# EAGLE schematic BlueCom_Board (EAGLE 6.2)
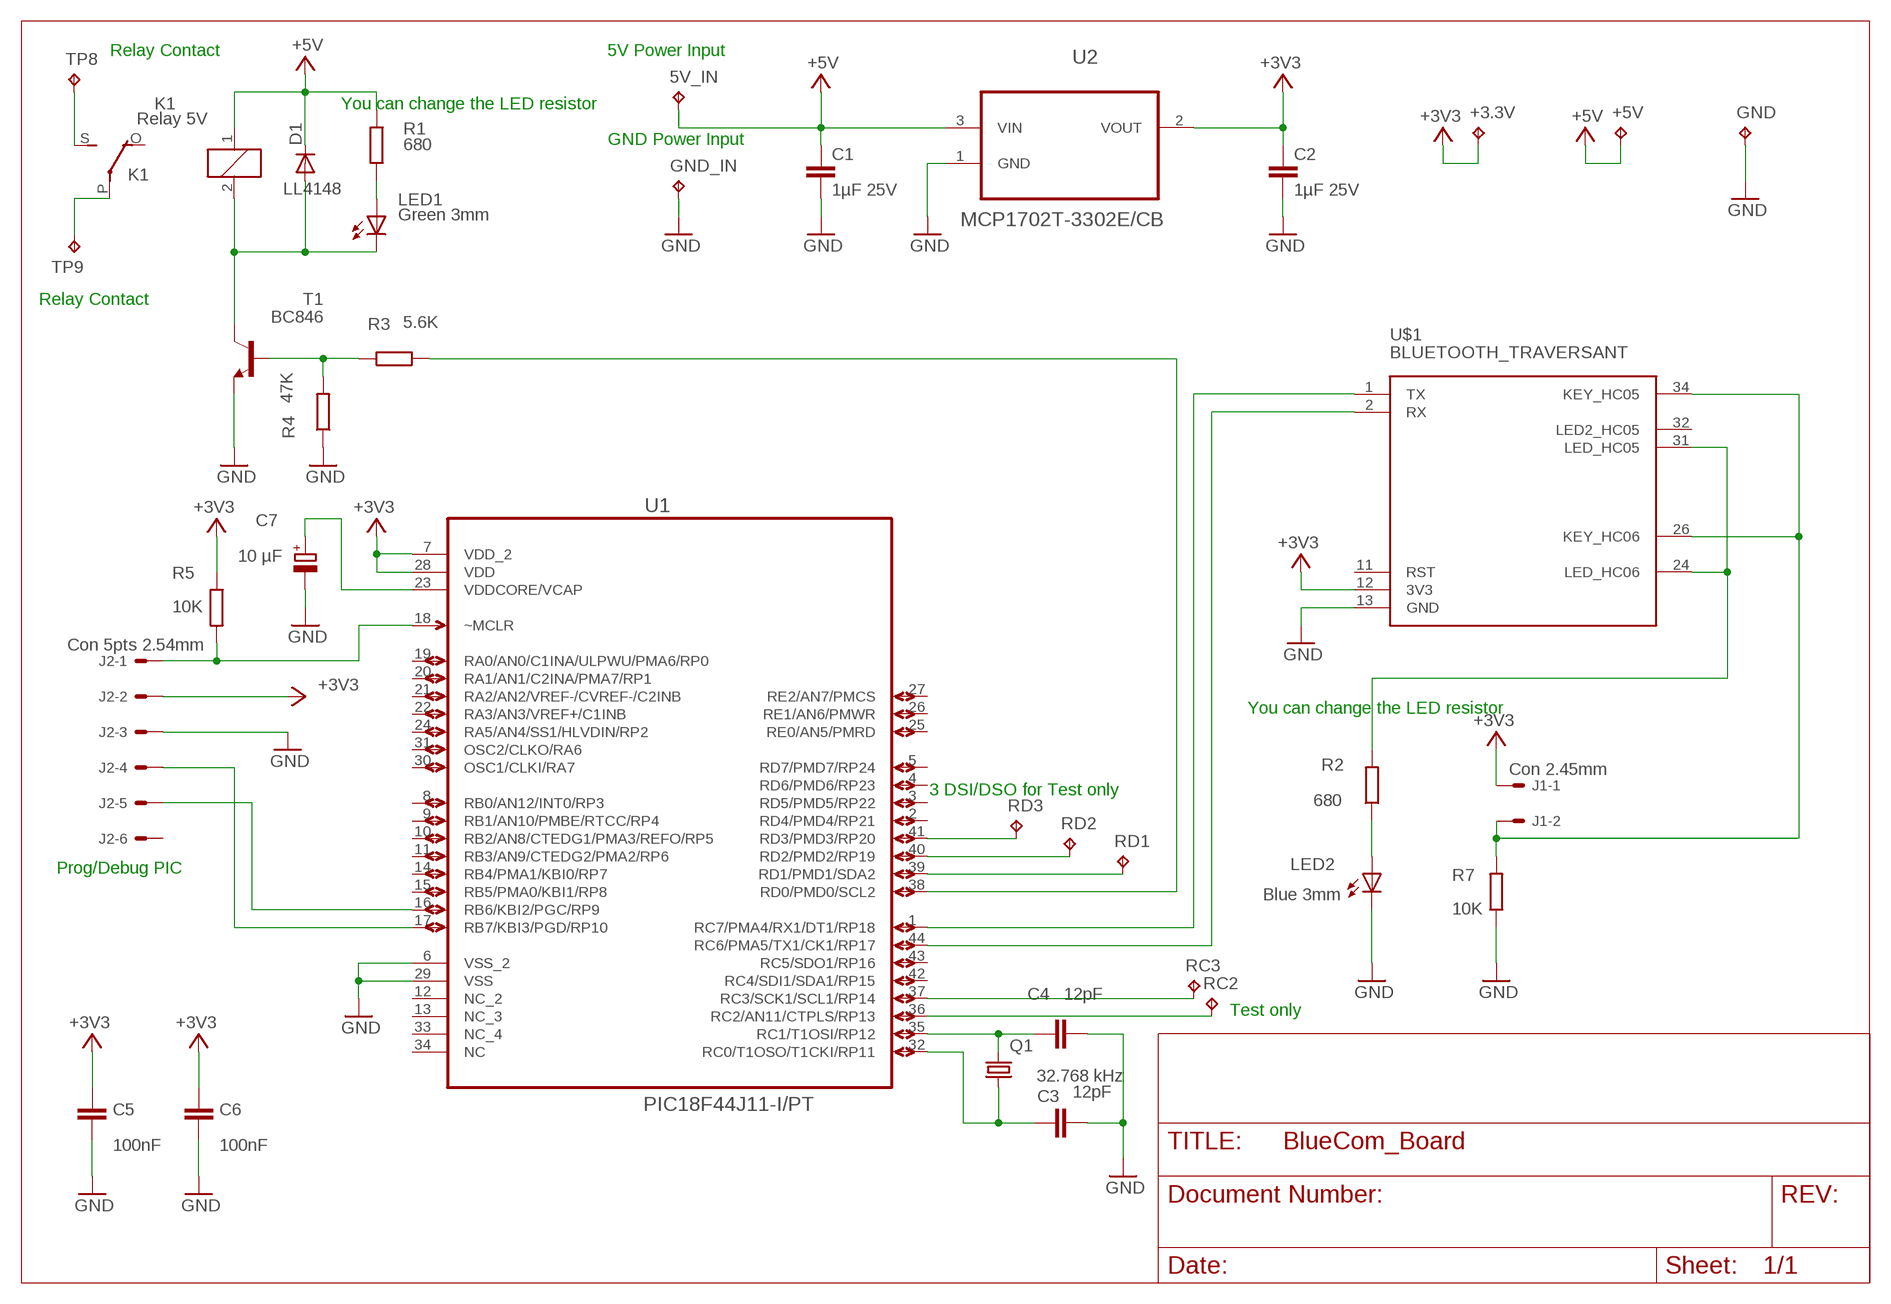
[diagram p0: schematic, sheet 1]

## Parts
5V_IN  TPPAD1-13Y  [P1-13Y]
+3.3V  TPPAD1-13  [P1-13]
+5V  TPPAD1-13  [P1-13]
C1  1µF 25V  C-EUC0805  [C0805]
C2  1µF 25V  C-EUC0805  [C0805]
C3  12pF  C-EUC0805  [C0805]
C4  12pF  C-EUC0805  [C0805]
C5  100nF  C-EUC0805  [C0805]
C6  100nF  C-EUC0805  [C0805]
C7  10 µF  CPOL-EUA/3216-18W  [A/3216-18W]
D1  LL4148  PMLL41SOD80C  [SOD80C]
GND  TPPAD1-13  [P1-13]
GND_IN  TPPAD1-13Y  [P1-13Y]
J1  Con 2.45mm  22-27-2021-02  [6410-02]
J2  Con 5pts 2.54mm  22-27-2061-06  [6410-06]
K1  Relay 5V  ZF112  [ZF112]
LED1  Green 3mm  LED3MM  [LED3MM]
LED2  Blue 3mm  LED3MM  [LED3MM]
Q1  32.768 kHz  CRYSTALTC26H  [TC26H]
R1  680  R-EU_R0805  [R0805]
R2  680  R-EU_R0805  [R0805]
R3  5.6K  R-EU_R0805  [R0805]
R4  47K  R-EU_R0805  [R0805]
R5  10K  R-EU_R0805  [R0805]
R7  10K  R-EU_R0805  [R0805]
RC2  TPPAD1-13  [P1-13]
RC3  TPPAD1-13  [P1-13]
RD1  TPPAD1-13  [P1-13]
RD2  TPPAD1-13  [P1-13]
RD3  TPPAD1-13  [P1-13]
T1  BC846  [SOT23]
TP8  TPPAD1-13Y  TPPAD1-20Y  [P1-20Y]
TP9  TPPAD1-13Y  TPPAD1-20Y  [P1-20Y]
U1  PIC18F44J11-I/PT  [QFP80P1200X1200X120-44N]
U2  MCP1702T-3302E/CB  [SOT95P255X145-3N]
U$1  BLUETOOTH_TRAVERSANT  [BLUETOOTH_TRAVERSANT]

## Nets
+3V3: +3.3V.TP C2.1 C5.1 C6.1 J1.1 J2.2 R5.1 U1.7(VDD_2) U1.28(VDD) U2.2(VOUT) U$1.12(3V3)
+5V: 5V_IN.TP +5V.TP C1.1 D1.C K1.1 R1.2 U2.3(VIN)
GND: C1.2 C2.2 C3.2 C4.2 C5.2 C6.2 C7.- GND.TP GND_IN.TP J2.3 LED2.K(C) R4.1 R7.1 T1.2(E) U1.6(VSS_2) U1.29(VSS) U2.1(GND) U$1.13(GND)
N$1: D1.A K1.2 LED1.K(C) T1.3(C)
N$2: R3.1 R4.2 T1.1(B)
N$3: RD3.TP U1.41(RD3/PMD3/RP20)
N$4: LED1.A R1.1
N$5: LED2.A R2.1
N$6: R2.2 U$1.24(LED_HC06) U$1.31(LED_HC05)
N$7: J1.2 R7.2 U$1.26(KEY_HC06) U$1.34(KEY_HC05)
N$8: U1.44(RC6/PMA5/TX1/CK1/RP17) U$1.2(RX)
N$9: U1.1(RC7/PMA4/RX1/DT1/RP18) U$1.1(TX)
N$10: K1.S(2:S) TP8.TP
N$11: K1.P(2:P) TP9.TP
N$12: J2.1 R5.2 U1.18(~MCLR)
N$13: C4.1 Q1.2 U1.35(RC1/T1OSI/RP12)
N$14: C3.1 Q1.1 U1.32(RC0/T1OSO/T1CKI/RP11)
N$15: J2.5 U1.16(RB6/KBI2/PGC/RP9)
N$16: RD2.TP U1.40(RD2/PMD2/RP19)
N$17: C7.+ U1.23(VDDCORE/VCAP)
N$18: R3.2 U1.38(RD0/PMD0/SCL2)
N$19: J2.4 U1.17(RB7/KBI3/PGD/RP10)
N$20: RD1.TP U1.39(RD1/PMD1/SDA2)
N$21: RC2.TP U1.36(RC2/AN11/CTPLS/RP13)
N$22: RC3.TP U1.37(RC3/SCK1/SCL1/RP14)
Unconnected: J2.6 K1.O(2:O) U1.2(RD4/PMD4/RP21) U1.3(RD5/PMD5/RP22) U1.4(RD6/PMD6/RP23) U1.5(RD7/PMD7/RP24) U1.8(RB0/AN12/INT0/RP3) U1.9(RB1/AN10/PMBE/RTCC/RP4) U1.10(RB2/AN8/CTEDG1/PMA3/REFO/RP5) U1.11(RB3/AN9/CTEDG2/PMA2/RP6) U1.12(NC_2) U1.13(NC_3) U1.14(RB4/PMA1/KBI0/RP7) U1.15(RB5/PMA0/KBI1/RP8) U1.19(RA0/AN0/C1INA/ULPWU/PMA6/RP0) U1.20(RA1/AN1/C2INA/PMA7/RP1) U1.21(RA2/AN2/VREF-/CVREF-/C2INB) U1.22(RA3/AN3/VREF+/C1INB) U1.24(RA5/AN4/SS1/HLVDIN/RP2) U1.25(RE0/AN5/PMRD) U1.26(RE1/AN6/PMWR) U1.27(RE2/AN7/PMCS) U1.30(OSC1/CLKI/RA7) U1.31(OSC2/CLKO/RA6) U1.33(NC_4) U1.34(NC) U1.42(RC4/SDI1/SDA1/RP15) U1.43(RC5/SDO1/RP16) U$1.11(RST) U$1.32(LED2_HC05)

## Notes on the sheet
- Relay Contact | 5V Power Input
- You can change the LED resistor
- GND Power Input
- Relay Contact
- You can change the LED resistor
- 3 DSI/DSO for Test only
- Prog/Debug PIC
- Test only

## Library data of the parts
5V_IN +3.3V +5V GND GND_IN RC2 RC3 RD1-RD3 TP8 TP9 = testpad:TP: Test pad
C1-C6 = rcl:C-EU: CAPACITOR, European symbol
C7 = rcl:CPOL-EU: POLARIZED CAPACITOR, European symbol
D1 = diode:PMLL41*: High-speed diodes Source: http://www.semiconductors.philips.com/acrobat_download/datasheets/PMLL4150_2.pdf
J1 = con-molex:22-?-02: CONNECTOR wire to board 2.54 mm (.1 inch) pitch header; OC_FARNELL: unknown; OC_NEWARK: unknown
J2 = con-molex:22-?-06: CONNECTOR wire to board 2.54 mm (.1 inch) pitch header; OC_FARNELL: unknown; OC_NEWARK: unknown
K1 = relay:ZF112: RELAY 1 x switch; OC_FARNELL: unknown; OC_NEWARK: unknown
LED1 LED2 = led:LED: LED OSRAM: - CHIPLED LG R971, LG N971, LY N971, LG Q971, LY Q971, LO R971, LY R971 LH N974, LH R974 LS Q976, LO Q976, LY Q976 LO Q996 - Hyper CHIPLED LW Q18S LB Q993, LB Q99A, LB R99A - SideLED LS A670, LO A670, LY A670, LG A670, LP A670 LB A673, LV A673, LT A673, LW A673 LH A674 LY A675 LS A676, LA A676, LO A676, LY A676, LW A676 LS A679, LY A679, LG A679 - Hyper Micro SIDELED® LS Y876, LA Y876, LO Y876, LY Y876 LT Y87S - SmartLED LW L88C, LW L88S LB L89C, LB L89S, LG L890 LS L89K, LO L89K, LY L89K LS L896, LA L896, LO L896, LY L896 - TOPLED LS T670, LO T670, LY T670, LG T670, LP T670 LSG T670, LSP T670, LSY T670, LOP T670, LYG T670 LG T671, LOG T671, LSG T671 LB T673, LV T673, LT T673, LW T673 LH T674 LS T676, LA T676, LO T676, LY T676, LB T676, LH T676, LSB T676, LW T676 LB T67C, LV T67C, LT T67C, LS T67K, LO T67K, LY T67K, LW E67C LS E67B, LA E67B, LO E67B, LY E67B, LB E67C, LV E67C, LT E67C LW T67C LS T679, LY T679, LG T679 LS T770, LO T770, LY T770, LG T770, LP T770 LB T773, LV T773, LT T773, LW T773 LH T774 LS E675, LA E675, LY E675, LS T675 LS T776, LA T776, LO T776, LY T776, LB T776 LHGB T686 LT T68C, LB T68C - Hyper Mini TOPLED® LB M676 - Mini TOPLED Santana® LG M470 LS M47K, LO M47K, LY M47K Source: http://www.osram.convergy.de LUXEON: - LUMILED® LXK2-PW12-R00, LXK2-PW12-S00, LXK2-PW14-U00, LXK2-PW14-V00 LXK2-PM12-R00, LXK2-PM12-S00, LXK2-PM14-U00 LXK2-PE12-Q00, LXK2-PE12-R00, LXK2-PE12-S00, LXK2-PE14-T00, LXK2-PE14-U00 LXK2-PB12-K00, LXK2-PB12-L00, LXK2-PB12-M00, LXK2-PB14-N00, LXK2-PB14-P00, LXK2-PB14-Q00 LXK2-PR12-L00, LXK2-PR12-M00, LXK2-PR14-Q00, LXK2-PR14-R00 LXK2-PD12-Q00, LXK2-PD12-R00, LXK2-PD12-S00 LXK2-PH12-R00, LXK2-PH12-S00 LXK2-PL12-P00, LXK2-PL12-Q00, LXK2-PL12-R00 Source: www.luxeon.com KINGBRIGHT: KA-3528ASYC Source: www.kingbright.com
Q1 = crystal:CRYSTAL: CRYSTAL; OC_FARNELL: unknown; OC_NEWARK: unknown
R1-R5 R7 = resistor:R-EU_: RESISTOR, European symbol
T1 = transistor:BC846: NPN TRANSISTOR
U1 = BlueCom_Lib:PIC18F44J11-I/PT: High-Performance Microcontrollers; DESCRIPTION: 8BIT MCU; MPN: pic18f44j11-I/pt; OC_FARNELL: 1702900; OC_NEWARK: 98M1811; PACKAGE: TQFP-44; SUPPLIER: Microchip
U2 = BlueCom_Lib:MCP1702T-3302E/CB: 250 mA Low Quiescent Current LDO Regulator; MPN: MCP1702T-3302E/CB; OC_FARNELL: 1331490; OC_NEWARK: 84R5179; PACKAGE: SOT23-3; SUPPLIER: Microchip
U$1 = BlueCom_Lib:BLUETOOTH_TRAVERSANT